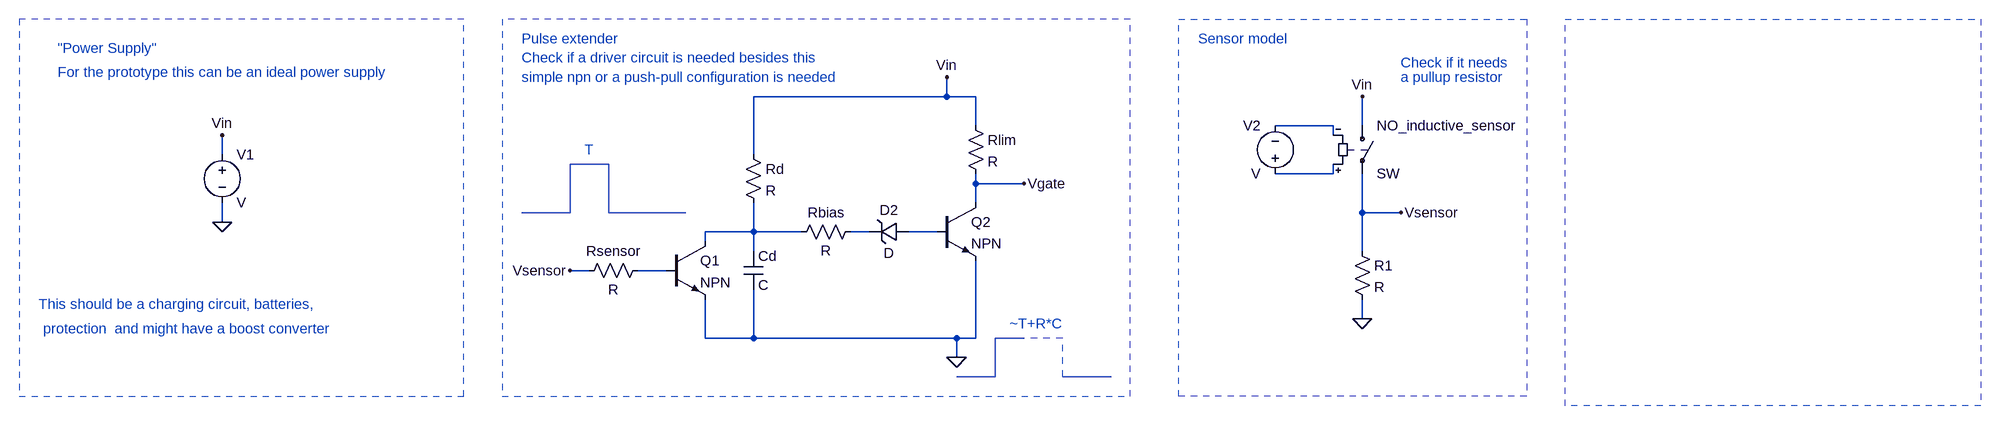
[diagram p0: schematic pulse_extender.asc]
pulse_extender.asc, the LTspice schematic file:
Version 4
SHEET 1 3884 12304
WIRE 432 -80 432 -112
WIRE 432 -80 112 -80
WIRE 480 -80 432 -80
WIRE 480 -32 480 -80
WIRE 1072 -32 976 -32
WIRE 1120 -32 1120 -80
WIRE 1072 -16 1072 -32
WIRE -768 16 -768 -16
WIRE 112 16 112 -80
WIRE 1072 48 1072 32
WIRE 1072 48 976 48
WIRE 480 64 480 48
WIRE 560 64 480 64
WIRE 480 96 480 64
WIRE 1120 112 1120 48
WIRE 1184 112 1120 112
WIRE -768 128 -768 96
WIRE 112 144 112 96
WIRE 112 144 32 144
WIRE 192 144 112 144
WIRE 304 144 272 144
WIRE 416 144 368 144
WIRE 32 160 32 144
WIRE 112 176 112 144
WIRE 1120 176 1120 112
WIRE -160 208 -192 208
WIRE -32 208 -80 208
WIRE 1120 288 1120 256
WIRE 32 320 32 256
WIRE 112 320 112 240
WIRE 112 320 32 320
WIRE 448 320 112 320
WIRE 480 320 480 192
WIRE 480 320 448 320
WIRE 448 352 448 320
FLAG -768 -16 Vin
FLAG -768 128 0
FLAG 1120 -80 Vin
FLAG 1184 112 Vsensor
FLAG 1120 288 0
FLAG -192 208 Vsensor
FLAG 432 -112 Vin
FLAG 448 352 0
FLAG 560 64 Vgate
SYMBOL voltage -768 0 R0
SYMATTR InstName V1
SYMBOL sw 1120 -48 R0
SYMATTR InstName NO_inductive_sensor
SYMBOL voltage 976 64 R180
WINDOW 0 24 96 Left 2
WINDOW 3 24 16 Left 2
SYMATTR InstName V2
SYMBOL res 1104 160 R0
SYMATTR InstName R1
SYMBOL res -64 192 R90
WINDOW 0 0 56 VBottom 2
WINDOW 3 32 56 VTop 2
SYMATTR InstName Rsensor
SYMBOL npn -32 160 R0
SYMATTR InstName Q1
SYMBOL cap 96 176 R0
SYMATTR InstName Cd
SYMBOL res 96 0 R0
SYMATTR InstName Rd
SYMBOL res 288 128 R90
WINDOW 0 0 56 VBottom 2
WINDOW 3 32 56 VTop 2
SYMATTR InstName Rbias
SYMBOL zener 368 128 R90
WINDOW 0 -4 32 VBottom 2
WINDOW 3 36 32 VTop 2
SYMATTR InstName D2
SYMBOL npn 416 96 R0
SYMATTR InstName Q2
SYMBOL res 464 -48 R0
SYMATTR InstName Rlim
TEXT -1040 -160 Left 2 ;"Power Supply"
TEXT 1184 -136 Left 2 ;Check if it needs
TEXT 1184 -112 Left 2 ;a pullup resistor
TEXT 848 -176 Left 2 ;Sensor model
TEXT -272 -176 Left 2 ;Pulse extender
TEXT 536 296 Left 2 ;~T+R*C
TEXT -168 8 Left 2 ;T
TEXT -272 -144 Left 2 ;Check if a driver circuit is needed besides this
TEXT -272 -112 Left 2 ;simple npn or a push-pull configuration is needed
TEXT -1040 -120 Left 2 ;For the prototype this can be an ideal power supply
TEXT -1072 264 Left 2 ;This should be a charging circuit, batteries,
TEXT -1064 304 Left 2 ;protection  and might have a boost converter
LINE Normal 512 384 448 384
LINE Normal 512 320 512 384
LINE Normal 560 320 512 320
LINE Normal 624 320 560 320 1
LINE Normal 624 384 624 320 1
LINE Normal 704 384 624 384
LINE Normal -192 112 -272 112
LINE Normal -192 32 -192 112
LINE Normal -128 32 -192 32
LINE Normal -128 112 -128 32
LINE Normal 0 112 -128 112
RECTANGLE Normal 2144 432 1456 -208 2
RECTANGLE Normal 1392 416 816 -208 2
RECTANGLE Normal -304 416 736 -208 2
RECTANGLE Normal -1104 416 -368 -208 2

The netlist it stands for:
* pulse_extender.asc
V1 Vin 0 V
S§NO_inductive_sensor Vin Vsensor N002 N001 SW
V2 N002 N001 V
R1 Vsensor 0 R
Rsensor N006 Vsensor R
Q1 N003 N006 0 0 NPN
Cd N003 0 C
Rd Vin N003 R
Rbias N004 N003 R
D2 N005 N004 D
Q2 Vgate N005 0 0 NPN
Rlim Vin Vgate R
.model D D
.lib standard.dio
.model NPN NPN
.model PNP PNP
.lib standard.bjt
* "Power Supply"
* Check if it needs
* a pullup resistor
* Sensor model
* Pulse extender
* ~T+R*C
* T
* Check if a driver circuit is needed besides this
* simple npn or a push-pull configuration is needed
* For the prototype this can be an ideal power supply
* This should be a charging circuit, batteries,
* protection  and might have a boost converter
.backanno
.end